# EasyEDA schematic satima clone.json
TITLE: Sheet_1; REV: 1.0; Date: 2022-11-27; Sheet: 1/1; Company: Your Company
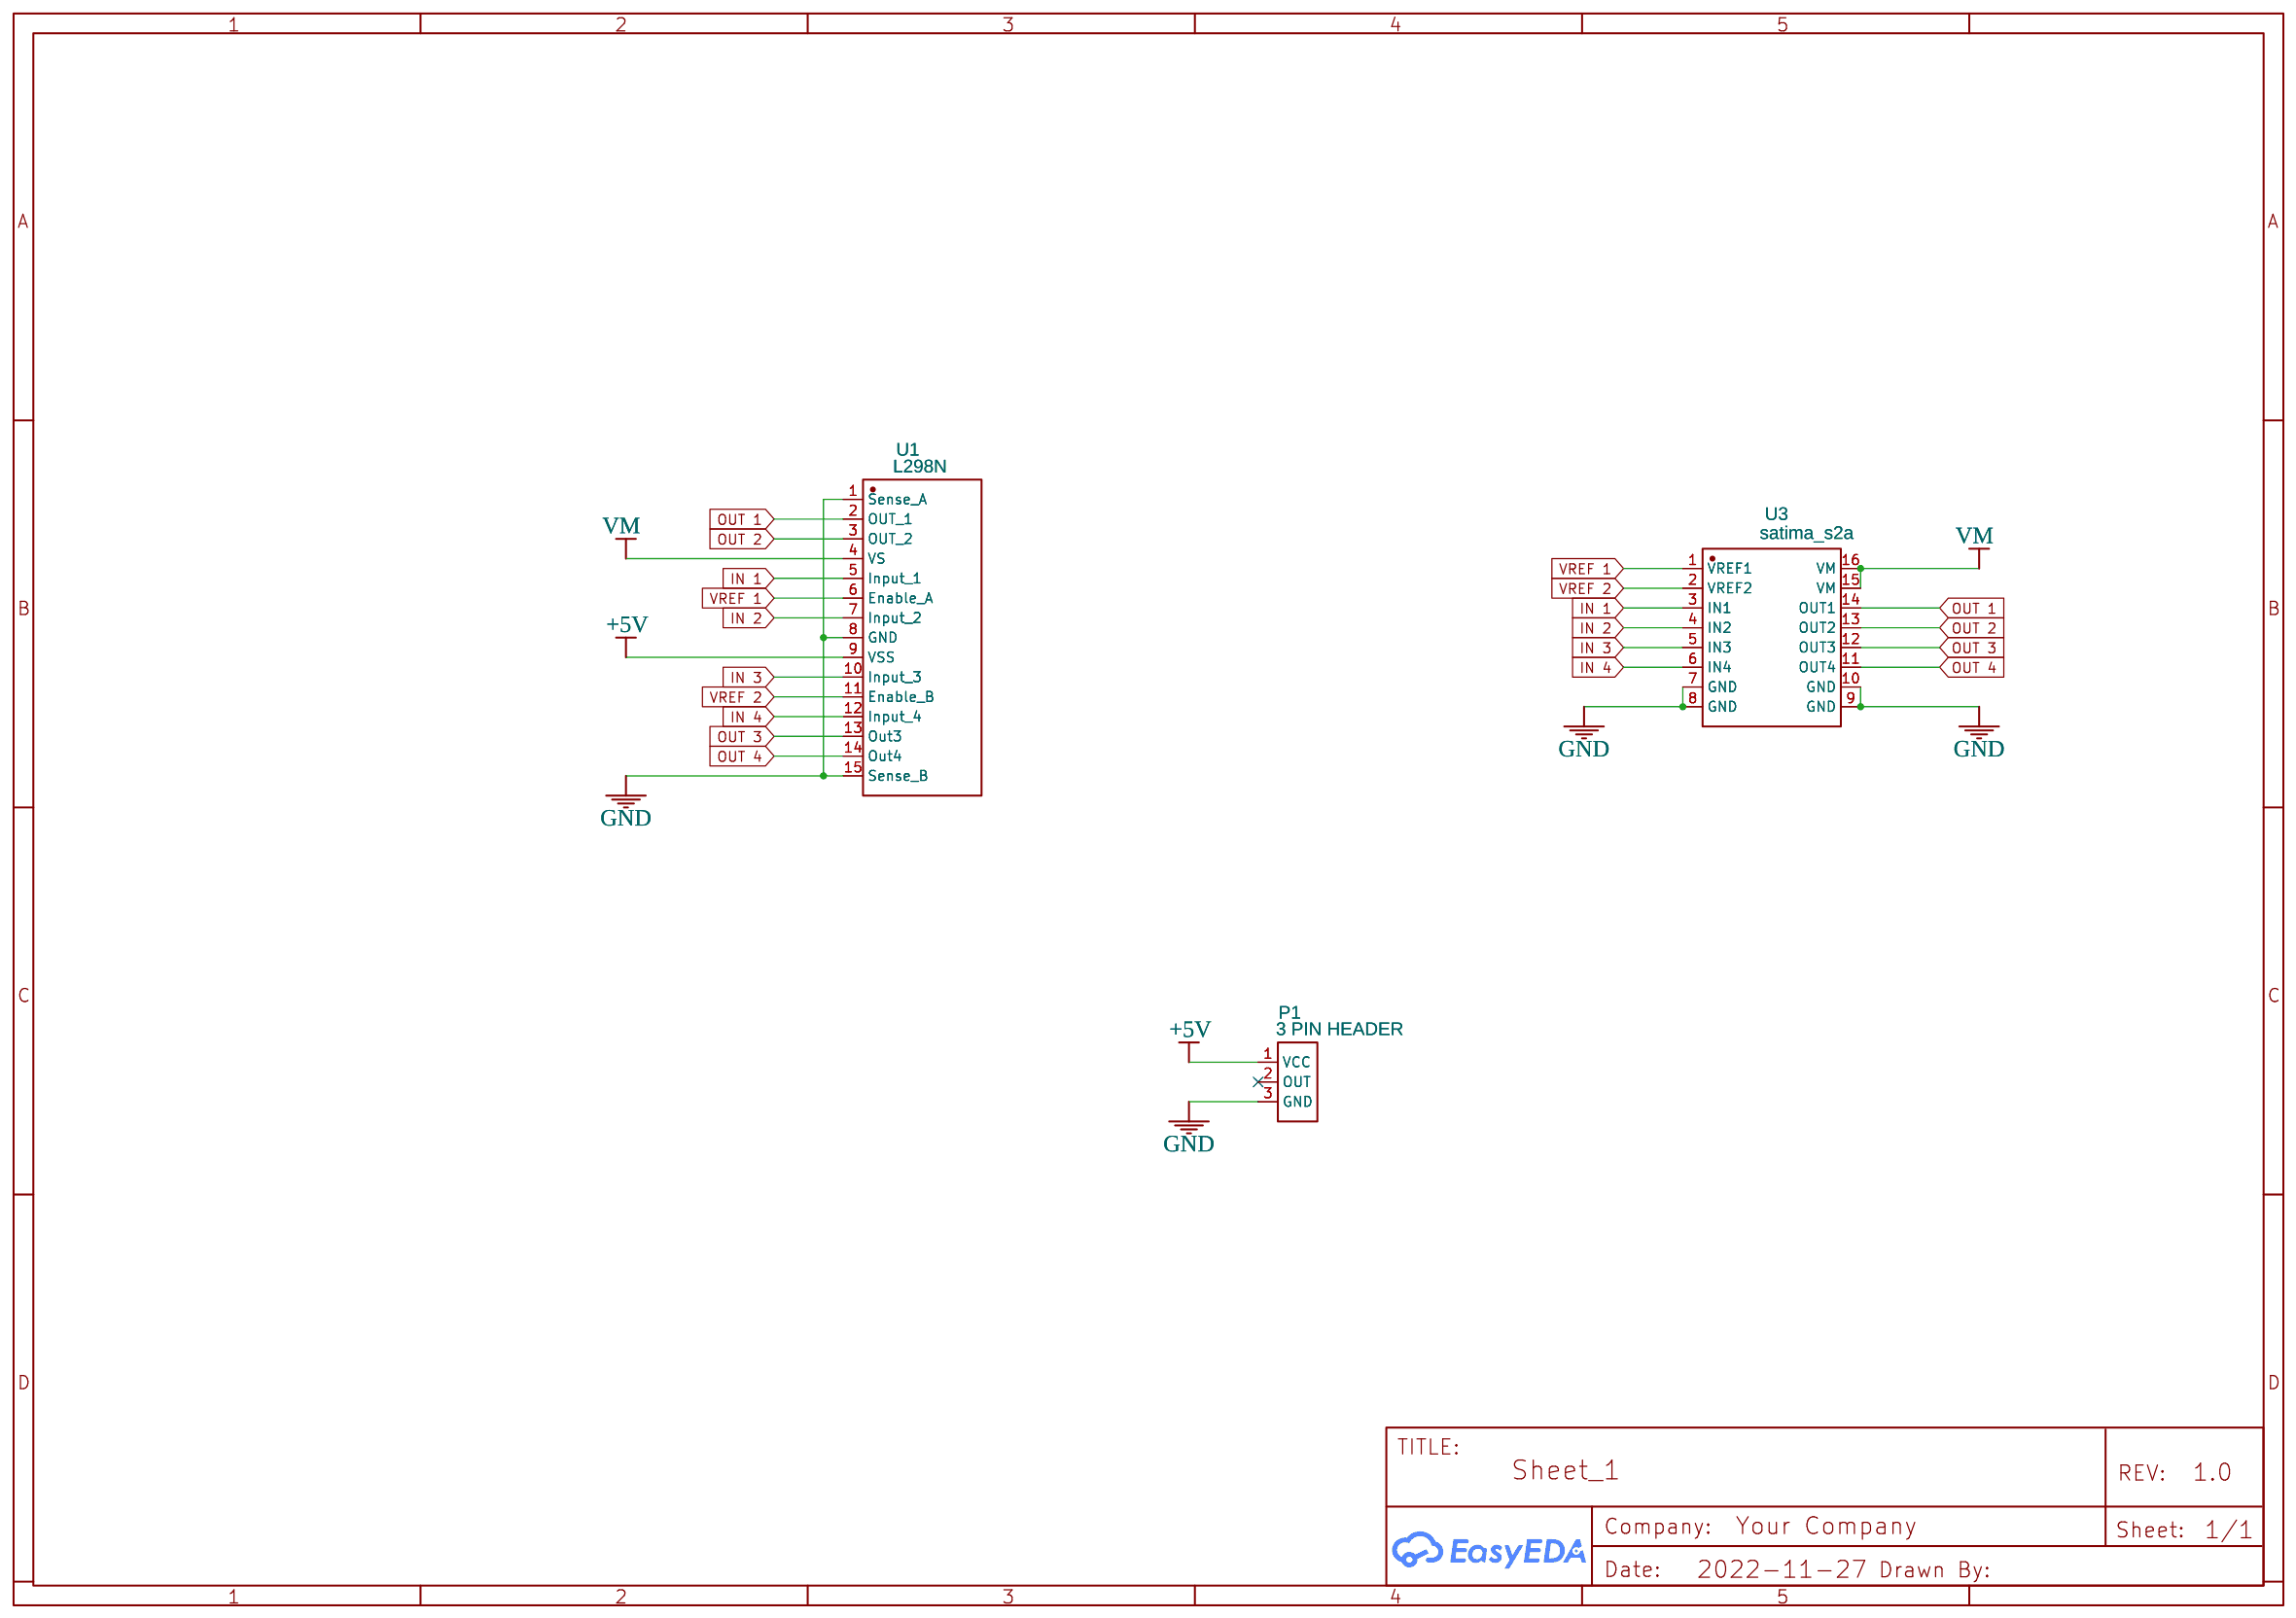
[diagram p0: schematic sheet]

## Parts
P1  3 PIN HEADER  [HEADER-PINS_2.54_04PIN_01ROW]
U1  L298N  [MULTIWATT-15_L19.6-W5.0-P1.27-L]
U3  satima_s2a  [SATIMA S2A_V1]

## Library data of the parts
P1 = 3 PIN HEADER: Contributor: sergio07
U1 = L298N: Supplier: LCSC; Supplier Part: C434589; Manufacturer: HGSEMI; Contributor: LCSC; JLCPCB Part Class: Extended Part
U3 = satima_s2a: Manufacturer: 0x6flab; link: https://github.com/0x6flab/satima-board; Contributor: rodneydav

## Nets
+5V: P1.1(VCC) U1.9(VSS)
GND: P1.3(GND) U1.1(Sense A) U1.8(GND) U1.15(Sense B) U3.7(GND) U3.8(GND) U3.9(GND) U3.10(GND)
IN 1: U1.5(Input 1) U3.3(IN1)
IN 2: U1.7(Input 2) U3.4(IN2)
IN 3: U1.10(Input 3) U3.5(IN3)
IN 4: U1.12(Input 4) U3.6(IN4)
OUT 1: U1.2(OUT 1) U3.14(OUT1)
OUT 2: U1.3(OUT 2) U3.13(OUT2)
OUT 3: U1.13(Out3) U3.12(OUT3)
OUT 4: U1.14(Out4) U3.11(OUT4)
VM: U1.4(VS) U3.15(VM) U3.16(VM)
VREF 1: U1.6(Enable A) U3.1(VREF1)
VREF 2: U1.11(Enable B) U3.2(VREF2)

Not connected (* = marked no-connect by the designer): P1 2(OUT)*
